# EAGLE design module_ESP07 (EAGLE 9.4.1)
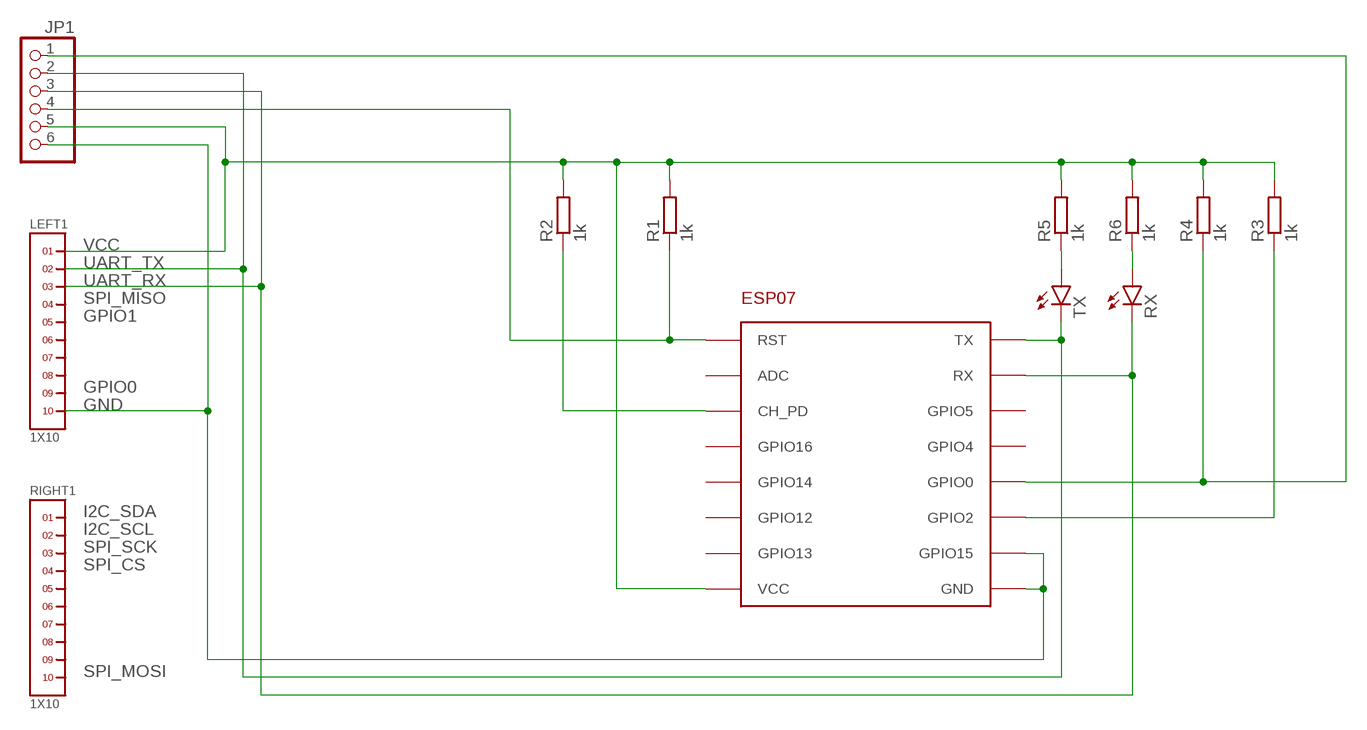
[diagram p0: schematic, sheet 1]

## Parts
JP1  PINHD-1X6  [1X06]
LEFT1  1X10  [1X10]
R1  1k  R-EU_R0603  [R0603]
R2  1k  R-EU_R0603  [R0603]
R3  1k  R-EU_R0603  [R0603]
R4  1k  R-EU_R0603  [R0603]
R5  1k  R-EU_R0603  [R0603]
R6  1k  R-EU_R0603  [R0603]
RIGHT1  1X10  [1X10]
RX  LEDCHIPLED_0603  [CHIPLED_0603]
TX  LEDCHIPLED_0603  [CHIPLED_0603]
U$1  ESP-07  [ESP07]

## Nets
GND: JP1.6 LEFT1.10 U$1.GND U$1.GPIO15
GPIO0: JP1.1 R4.1 U$1.GPIO0
N$3: R6.1 RX.A
N$4: R5.1 TX.A
N$6: R2.1 U$1.CH_PD
N$7: R3.1 U$1.GPIO2
RST: JP1.4 R1.1 U$1.RST
UART_RX: JP1.3 LEFT1.3 RX.C U$1.RX
UART_TX: JP1.2 LEFT1.2 TX.C U$1.TX
VCC: JP1.5 LEFT1.1 R1.2 R2.2 R3.2 R4.2 R5.2 R6.2 U$1.VCC
Unconnected: LEFT1.4 LEFT1.5 LEFT1.6 LEFT1.7 LEFT1.8 LEFT1.9 RIGHT1.1 RIGHT1.2 RIGHT1.3 RIGHT1.4 RIGHT1.5 RIGHT1.6 RIGHT1.7 RIGHT1.8 RIGHT1.9 RIGHT1.10 U$1.ADC U$1.GPIO4 U$1.GPIO5 U$1.GPIO12 U$1.GPIO13 U$1.GPIO14 U$1.GPIO16

## Notes on the sheet
- VCC
- UART_TX
- UART_RX
- SPI_MISO
- GPIO1
- GPIO0
- GND
- I2C_SDA
- I2C_SCL
- SPI_SCK
- SPI_CS
- SPI_MOSI

## Library data of the parts
JP1 = pinhead:PINHD-1X6: PIN HEADER
LEFT1 RIGHT1 = headers(2mm):1X10
R1-R6 = rcl:R-EU_: RESISTOR, European symbol; SPICEPREFIX: R
RX TX = led:LED: LED OSRAM: - CHIPLED LG R971, LG N971, LY N971, LG Q971, LY Q971, LO R971, LY R971 LH N974, LH R974 LS Q976, LO Q976, LY Q976 LO Q996 - Hyper CHIPLED LW Q18S LB Q993, LB Q99A, LB R99A - SideLED LS A670, LO A670, LY A670, LG A670, LP A670 LB A673, LV A673, LT A673, LW A673 LH A674 LY A675 LS A676, LA A676, LO A676, LY A676, LW A676 LS A679, LY A679, LG A679 - Hyper Micro SIDELED® LS Y876, LA Y876, LO Y876, LY Y876 LT Y87S - SmartLED LW L88C, LW L88S LB L89C, LB L89S, LG L890 LS L89K, LO L89K, LY L89K LS L896, LA L896, LO L896, LY L896 - TOPLED LS T670, LO T670, LY T670, LG T670, LP T670 LSG T670, LSP T670, LSY T670, LOP T670, LYG T670 LG T671, LOG T671, LSG T671 LB T673, LV T673, LT T673, LW T673 LH T674 LS T676, LA T676, LO T676, LY T676, LB T676, LH T676, LSB T676, LW T676 LB T67C, LV T67C, LT T67C, LS T67K, LO T67K, LY T67K, LW E67C LS E67B, LA E67B, LO E67B, LY E67B, LB E67C, LV E67C, LT E67C LW T67C LS T679, LY T679, LG T679 LS T770, LO T770, LY T770, LG T770, LP T770 LB T773, LV T773, LT T773, LW T773 LH T774 LS E675, LA E675, LY E675, LS T675 LS T776, LA T776, LO T776, LY T776, LB T776 LHGB T686 LT T68C, LB T68C - Hyper Mini TOPLED® LB M676 - Mini TOPLED Santana® LG M470 LS M47K, LO M47K, LY M47K Source: http://www.osram.convergy.de LUXEON: - LUMILED® LXK2-PW12-R00, LXK2-PW12-S00, LXK2-PW14-U00, LXK2-PW14-V00 LXK2-PM12-R00, LXK2-PM12-S00, LXK2-PM14-U00 LXK2-PE12-Q00, LXK2-PE12-R00, LXK2-PE12-S00, LXK2-PE14-T00, LXK2-PE14-U00 LXK2-PB12-K00, LXK2-PB12-L00, LXK2-PB12-M00, LXK2-PB14-N00, LXK2-PB14-P00, LXK2-PB14-Q00 LXK2-PR12-L00, LXK2-PR12-M00, LXK2-PR14-Q00, LXK2-PR14-R00 LXK2-PD12-Q00, LXK2-PD12-R00, LXK2-PD12-S00 LXK2-PH12-R00, LXK2-PH12-S00 LXK2-PL12-P00, LXK2-PL12-Q00, LXK2-PL12-R00 Source: www.luxeon.com KINGBRIGHT: KA-3528ASYC Source: www.kingbright.com
U$1 = RadioShield:ESP-07

## Board
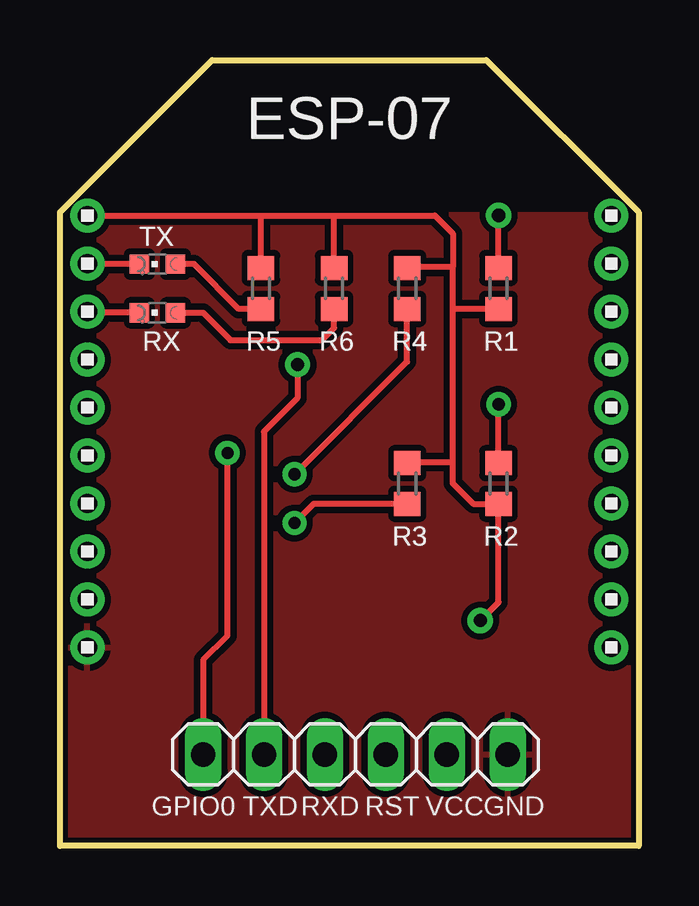
[diagram p1: board, top side]
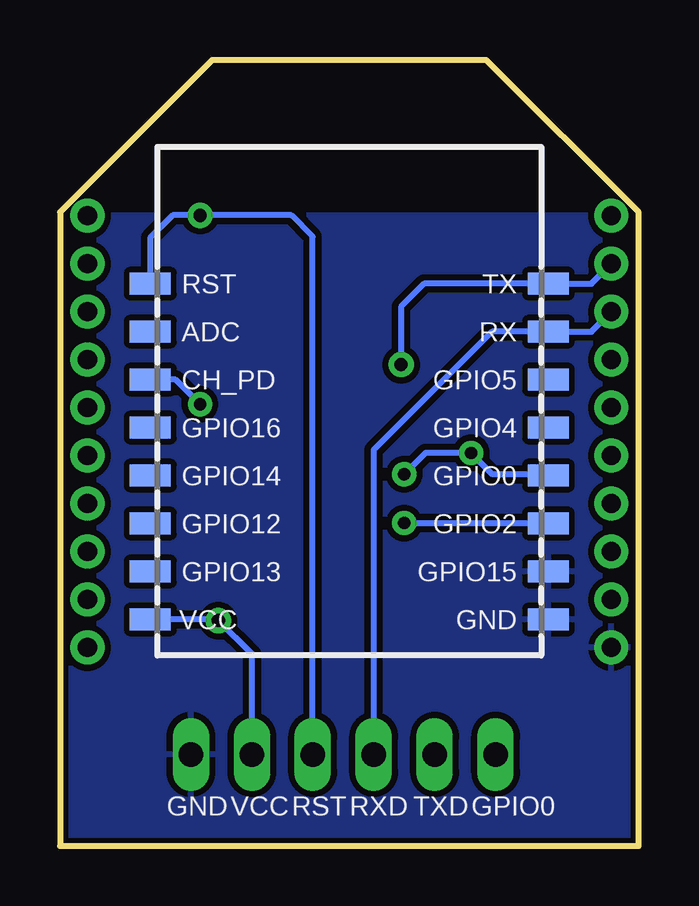
[diagram p2: board, bottom side, seen from below]

Size 24.13 x 32.77 mm. Coordinates in mm from the lower left corner, seen from the top.
Outline: 0,0 0,26.42 6.35,32.77 17.78,32.77 24.13,26.42 24.13,0 0,0
Copper layers (1*16): Top 0.035mm / dielectric 1.5mm / Bottom 0.035mm
Design rules "SparkFun-2-layer-STANDARD": minimum track width 10mil, minimum drill 20mil, track to track 10mil, track to pad 8mil, pad to pad 8mil, via to via 10mil, smd to smd 8mil, copper to edge 8mil, drill to drill 8mil, minimum pad ring 10mil, minimum via ring 10mil, stop-mask expansion 4mil, vias tented up to drill 25mil, thermal gap 10mil

### Footprints (pad centres in the part's own frame; a part is rotated, then mirrored left to right if it is on the bottom)
1X06 = drill 1.016 long: 1 -6.35,0; 2 -3.81,0; 3 -1.27,0; 4 1.27,0; 5 3.81,0; 6 6.35,0
1X10 = drill 0.8 pad 1.422: 1 -9,0; 2 -7,0; 3 -5,0; 4 -3,0; 5 -1,0; 6 1,0; 7 3,0; 8 5,0; 9 7,0; 10 9,0
R0603 = smd 1 x 1.1: 1 -0.85,0; 2 0.85,0
CHIPLED_0603 = smd 0.8 x 0.8: A 0,-0.75; C 0,0.75
ESP07 = smd 1.7 x 0.9: ADC -8.3,2.9; CH_PD -8.3,0.9; GND 8.3,-9.1; GPIO0 8.3,-3.1; GPIO2 8.3,-5.1; GPIO4 8.3,-1.1; GPIO5 8.3,0.9; GPIO12 -8.3,-5.1; GPIO13 -8.3,-7.1; GPIO14 -8.3,-3.1; GPIO15 8.3,-7.1; GPIO16 -8.3,-1.1; RST -8.3,4.9; RX 8.3,2.9; TX 8.3,4.9; VCC -8.3,-9.1

### Placement (x,y rotation side)
JP1  12.32,3.81 0 top
LEFT1  1.14,17.27 270 top
R1  18.29,23.24 270 top
R2  18.29,15.11 270 top
R3  14.48,15.11 90 top
R4  14.48,23.24 90 top
R5  8.38,23.24 90 top
R6  11.43,23.24 90 top
RIGHT1  22.99,17.27 270 top
RX  4.06,22.23 90 top
TX  4.06,24.26 90 top
U$1  12.06,18.54 0 bottom

### Tracks (layer width: path | path; a pad name or v marks a point on that pad's centre or on a via)
GND
  pour Top: -0.25,-0.25 24.38,-0.25 24.38,26.29 -0.25,26.29
  pour Bottom: -0.51,-0.51 24.64,-0.51 24.64,26.29 -0.51,26.29
GPIO0  (via drill 0.51)
  Top 0.254: JP1.1 5.97,7.75 6.99,8.76 v6.99,16.38 | R4.1 14.48,20.19 v9.78,15.49
  Bottom 0.254: U$1.GPIO0 3.82,15.49 6.1,15.49 v6.99,16.38 8.89,16.38 v9.78,15.49
N$3
  Top 0.254: RX.A 5.97,22.23 7.11,21.08 10.92,21.08 11.43,21.59 R6.1
N$4
  Top 0.254: R5.1 7.45,22.39 5.59,24.26 TX.A
N$6  (via drill 0.51)
  Top 0.254: R2.1 v18.29,18.42
  Bottom 0.254: v18.29,18.42 19.32,19.44 U$1.CH_PD
N$7  (via drill 0.51)
  Top 0.254: R3.1 10.58,14.26 v9.78,13.46
  Bottom 0.254: v9.78,13.46 3.79,13.46 U$1.GPIO2
RST  (via drill 0.55)
  Top 0.254: R1.1 v18.29,26.29
  Bottom 0.254: JP1.4 13.59,25.4 14.48,26.29 v18.29,26.29 19.43,26.29 20.37,25.36 U$1.RST
UART_RX
  Top 0.254: RX.C 1.19,22.23 LEFT1.3
  Bottom 0.254: JP1.3 11.05,16.51 6.12,21.44 U$1.RX 1.97,21.44 LEFT1.3
UART_TX  (via drill 0.55)
  Top 0.254: v9.91,20.07 9.91,18.67 8.51,17.27 JP1.2 | TX.C 1.16,24.26 LEFT1.2
  Bottom 0.254: v9.91,20.07 9.91,22.48 8.94,23.44 U$1.TX 1.97,23.44 LEFT1.2
VCC  (via drill 0.55)
  Top 0.254: LEFT1.1 8.38,26.27 | 8.38,26.27 11.43,26.27 | 11.43,26.27 15.6,26.27 15.62,26.29 16.38,25.53 16.38,24.13 | v17.53,9.4 18.29,10.16 R2.2 17.23,14.26 16.38,15.11 16.38,16 | 16.38,16 16.38,22.39 | 16.38,22.39 16.38,24.13 | 16.38,24.13 14.48,24.13 R4.2 | R1.2 16.38,22.39 | R3.2 14.52,16 16.38,16 | R5.2 8.38,26.27 | R6.2 11.43,26.27
  Bottom 0.254: JP1.5 16.13,8 v17.53,9.4 17.57,9.44 U$1.VCC

### Text on the board
tNames: ESP-07 | GPIO0 | TXD | RXD | RST | VCC | GND
bNames: GPIO0 | TXD | RXD | RST | VCC | GND
_tNames: TX | RX | R5 | R6 | R4 | R1 | R3 | R2